# Altium schematic sheet P07 Hi3531AV100(POWER).SchDoc
size 420 x 297 mm
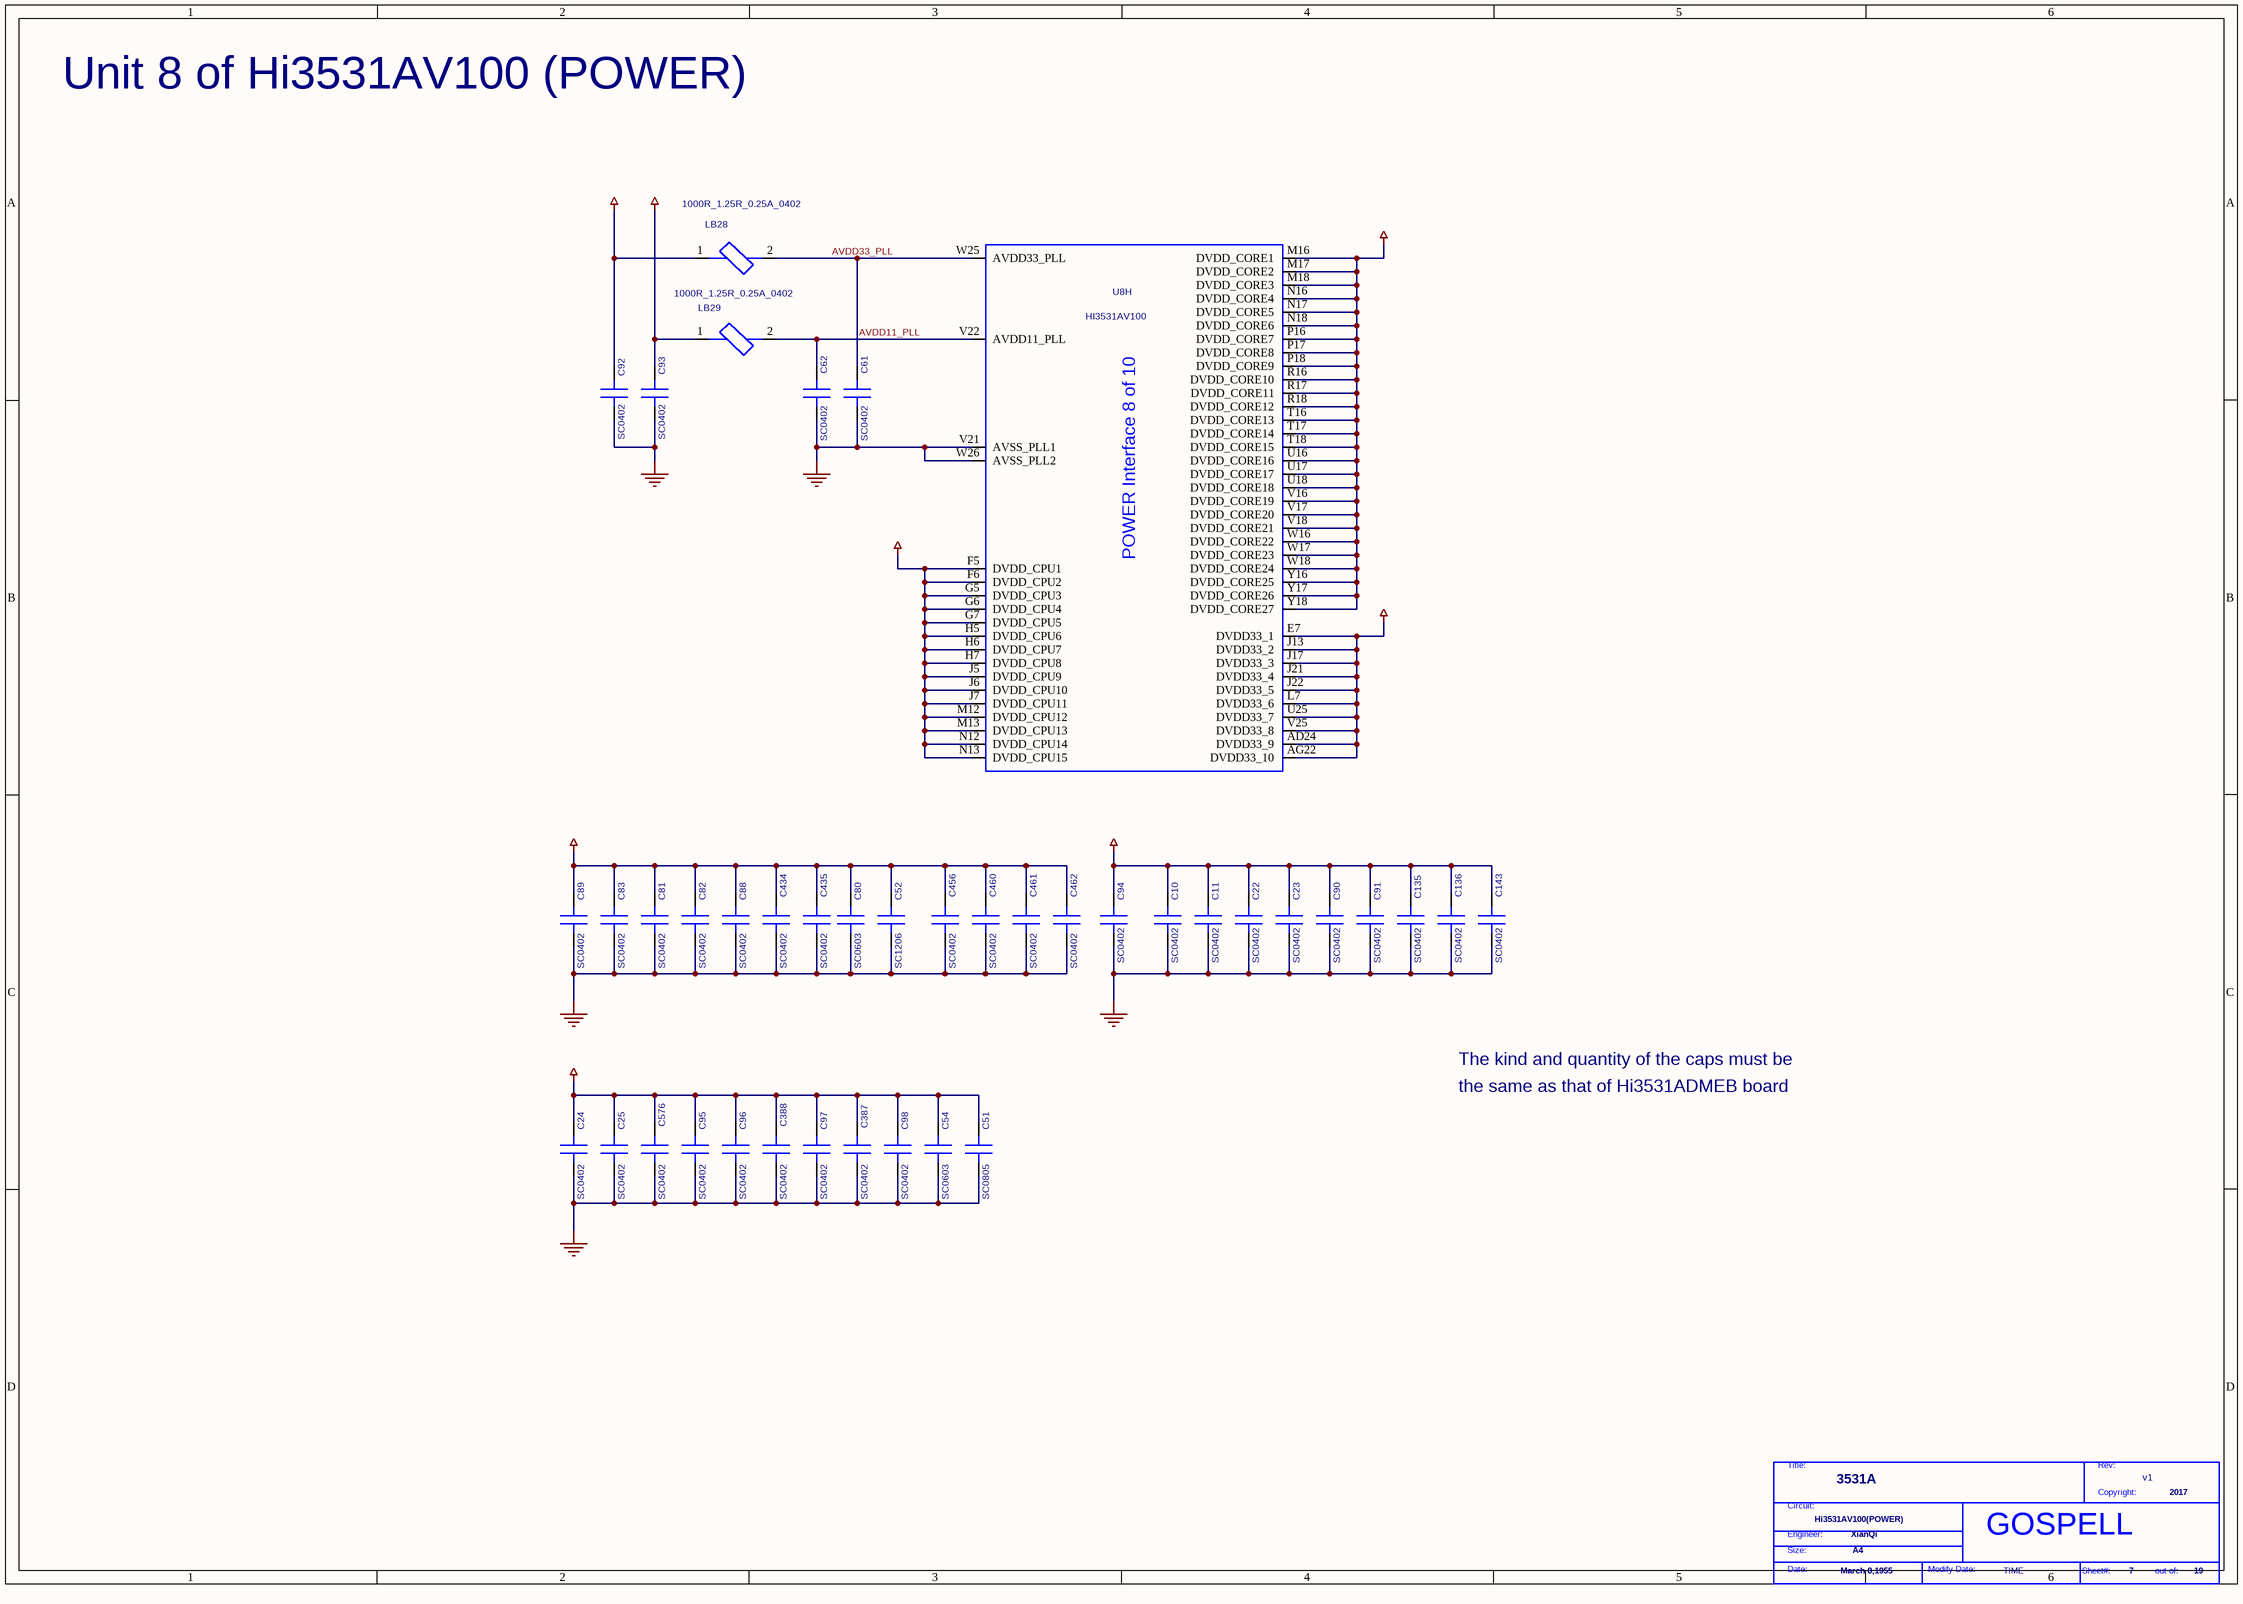
[diagram p0: P07 Hi3531AV100(POWER).SchDoc]

## Parts
*  Page Modify Date: TIME  Engineer: XianQi  Copyright: 2017  Title: 3531A  RevCode: v1  Page Size: A4  Page Create Date: March 8,1955  Page Number: 7  Page Count: 19  Doc: Hi3531AV100(POWER)  (hidden comment: GOSPELL)  (graphical)
C10  SC0402  [SC0402]
C11  SC0402  [SC0402]
C22  SC0402  [SC0402]
C23  SC0402  [SC0402]
C24  SC0402  [SC0402]
C25  SC0402  [SC0402]
C51  SC0805  [SC0805]
C52  SC1206  [SC1206]
C54  SC0603  [SC0603]
C61  SC0402  [SC0402]
C62  SC0402  [SC0402]
C80  SC0603  [SC0603]
C81  SC0402  [SC0402]
C82  SC0402  [SC0402]
C83  SC0402  [SC0402]
C88  SC0402  [SC0402]
C89  SC0402  [SC0402]
C90  SC0402  [SC0402]
C91  SC0402  [SC0402]
C92  SC0402  [SC0402]
C93  SC0402  [SC0402]
C94  SC0402  [SC0402]
C95  SC0402  [SC0402]
C96  SC0402  [SC0402]
C97  SC0402  [SC0402]
C98  SC0402  [SC0402]
C135  SC0402  [SC0402]
C136  SC0402  [SC0402]
C143  SC0402  [SC0402]
C387  SC0402  [SC0402]
C388  SC0402  [SC0402]
C434  SC0402  [SC0402]
C435  SC0402  [SC0402]
C456  SC0402  [SC0402]
C460  SC0402  [SC0402]
C461  SC0402  [SC0402]
C462  SC0402  [SC0402]
C576  SC0402  [SC0402]
LB28  SL0402  [SL0402]  (value not drawn)
LB29  SL0402  [SL0402]  (value not drawn)
U8  DEVICE: HI3531AV100  [BGA805-32-3333]  (hidden comment: BGA805-32-3333)  (part H of 10)

## Nets
3V3: C10.1(A) C11.1(A) C22.1(A) C23.1(A) C90.1(A) C91.1(A) C92.1(A) C94.1(A) C135.1(A) C136.1(A) C143.1(A) LB28.1 U8.AD24(DVDD33_9) U8.AG22(DVDD33_10) U8.E7(DVDD33_1) U8.J13(DVDD33_2) U8.J17(DVDD33_3) U8.J21(DVDD33_4) U8.J22(DVDD33_5) U8.L7(DVDD33_6) U8.U25(DVDD33_7) U8.V25(DVDD33_8)
DVDD_CORE: C24.1(A) C25.1(A) C51.1(A) C54.1(A) C93.1(A) C95.1(A) C96.1(A) C97.1(A) C98.1(A) C387.1(A) C388.1(A) C576.1(A) LB29.1 U8.M16(DVDD_CORE1) U8.M17(DVDD_CORE2) U8.M18(DVDD_CORE3) U8.N16(DVDD_CORE4) U8.N17(DVDD_CORE5) U8.N18(DVDD_CORE6) U8.P16(DVDD_CORE7) U8.P17(DVDD_CORE8) U8.P18(DVDD_CORE9) U8.R16(DVDD_CORE10) U8.R17(DVDD_CORE11) U8.R18(DVDD_CORE12) U8.T16(DVDD_CORE13) U8.T17(DVDD_CORE14) U8.T18(DVDD_CORE15) U8.U16(DVDD_CORE16) U8.U17(DVDD_CORE17) U8.U18(DVDD_CORE18) U8.V16(DVDD_CORE19) U8.V17(DVDD_CORE20) U8.V18(DVDD_CORE21) U8.W16(DVDD_CORE22) U8.W17(DVDD_CORE23) U8.W18(DVDD_CORE24) U8.Y16(DVDD_CORE25) U8.Y17(DVDD_CORE26) U8.Y18(DVDD_CORE27)
DVDD_CPU: C52.1(A) C80.1(A) C81.1(A) C82.1(A) C83.1(A) C88.1(A) C89.1(A) C434.1(A) C435.1(A) C456.1(A) C460.1(A) C461.1(A) C462.1(A) U8.F5(DVDD_CPU1) U8.F6(DVDD_CPU2) U8.G5(DVDD_CPU3) U8.G6(DVDD_CPU4) U8.G7(DVDD_CPU5) U8.H5(DVDD_CPU6) U8.H6(DVDD_CPU7) U8.H7(DVDD_CPU8) U8.J5(DVDD_CPU9) U8.J6(DVDD_CPU10) U8.J7(DVDD_CPU11) U8.M12(DVDD_CPU12) U8.M13(DVDD_CPU13) U8.N12(DVDD_CPU14) U8.N13(DVDD_CPU15)
GND: C10.2(B) C11.2(B) C22.2(B) C23.2(B) C24.2(B) C25.2(B) C51.2(B) C52.2(B) C54.2(B) C61.2(B) C62.2(B) C80.2(B) C81.2(B) C82.2(B) C83.2(B) C88.2(B) C89.2(B) C90.2(B) C91.2(B) C92.2(B) C93.2(B) C94.2(B) C95.2(B) C96.2(B) C97.2(B) C98.2(B) C135.2(B) C136.2(B) C143.2(B) C387.2(B) C388.2(B) C434.2(B) C435.2(B) C456.2(B) C460.2(B) C461.2(B) C462.2(B) C576.2(B) U8.V21(AVSS_PLL1) U8.W26(AVSS_PLL2)
AVDD11_PLL: C62.1(A) LB29.2 U8.V22(AVDD11_PLL)
AVDD33_PLL: C61.1(A) LB28.2 U8.W25(AVDD33_PLL)

## Notes on the sheet
- Unit 8 of Hi3531AV100 (POWER)
- (near LB28) 1000R_1.25R_0.25A_0402
- 1000R_1.25R_0.25A_0402
- The kind and quantity of the caps must be
- the same as that of Hi3531ADMEB board
- (in symbol GOSPELL) Title:; Rev:; Copyright:; Circuit:; Engineer:; Size:; Date:; Modify Date:; Sheet#:; out of:
- (in symbol HI3531AV100_M2_17, part H) POWER Interface 8 of 10

## Library data of the parts
C10 C23 C90 C135 C143 = C_0_Dup2: PARTS: 1; PINSWAP: (A,B); LEVEL: STD; DEVICE: RMEMK105BJ104KV_FR; OriginalSymbolOrigin: (0,30); %208%%161%%192%%224%%195%%251%%179%%198%: SMD陶瓷电容; COMPONENT_HIGH_MAX: 0.6MM; %182%%238%%182%%168%%185%%164%%215%%247%%181%%231%%209%%185%(V): 16; %195%%232%%202%%246%: SMD陶瓷电容-16V-100NF-+/-10%-X7R-0402-BT; CODE: 8070614; PKG_TYPE: SC0402
C11 C22 C91 C136 = C_0_Dup2: PARTS: 1; PINSWAP: (A,B); LEVEL: STD; DEVICE: RMEMK105BJ104KV_FR; OriginalSymbolOrigin: (0,30); CODE: 8070614; %195%%232%%202%%246%: SMD陶瓷电容-16V-100NF-+/-10%-X7R-0402-BT; %182%%238%%182%%168%%185%%164%%215%%247%%181%%231%%209%%185%(V): 16; COMPONENT_HIGH_MAX: 0.6MM; %208%%161%%192%%224%%195%%251%%179%%198%: SMD陶瓷电容; PKG_TYPE: SC0402
C24 C61 C82 C88 C92 C96 C98 C388 C434 C456 C461 C576 = C_0_Dup2: PARTS: 1; PINSWAP: (A,B); LEVEL: STD; DEVICE: CV05X5R105K10AH; OriginalSymbolOrigin: (0,30); %208%%161%%192%%224%%195%%251%%179%%198%: SMD陶瓷电容; COMPONENT_HIGH_MAX: 0.55MM; %182%%238%%182%%168%%185%%164%%215%%247%%181%%231%%209%%185%(V): 10; %195%%232%%202%%246%: SMD陶瓷电容-10V-1000NF-+/-10%-X5R-0402-BT,TS16949; CODE: 8070612; PKG_TYPE: SC0402
C25 C62 C81 C83 C89 C93 C95 C97 C387 C435 C460 C462 = C_0_Dup2: PARTS: 1; PINSWAP: (A,B); LEVEL: STD; DEVICE: CV05X5R105K10AH; OriginalSymbolOrigin: (0,30); CODE: 8070612; %195%%232%%202%%246%: SMD陶瓷电容-10V-1000NF-+/-10%-X5R-0402-BT,TS16949; %182%%238%%182%%168%%185%%164%%215%%247%%181%%231%%209%%185%(V): 10; COMPONENT_HIGH_MAX: 0.55MM; %208%%161%%192%%224%%195%%251%%179%%198%: SMD陶瓷电容; PKG_TYPE: SC0402
C51 = C_0_Dup2: PARTS: 1; PINSWAP: (A,B); LEVEL: STD; DEVICE: C2012X5R0J226MT000N; OriginalSymbolOrigin: (0,30); %208%%161%%192%%224%%195%%251%%179%%198%: SMD陶瓷电容; COMPONENT_HIGH_MAX: 1.35MM; %182%%238%%182%%168%%185%%164%%215%%247%%181%%231%%209%%185%(V): 6.3; %195%%232%%202%%246%: SMD陶瓷电容-6.3V-22000NF-+/-20%-X5R-0805-08070784编码拆分供华为技术使用; CODE: 8071114; PKG_TYPE: SC0805
C52 = C_0_Dup2: PARTS: 1; PINSWAP: (A,B); LEVEL: STD; DEVICE: GRM31CR60J226ME19L; OriginalSymbolOrigin: (0,30); %208%%161%%192%%224%%195%%251%%179%%198%: SMD陶瓷电容; COMPONENT_HIGH_MAX: 1.9MM; %182%%238%%182%%168%%185%%164%%215%%247%%181%%231%%209%%185%(V): 6.3; %195%%232%%202%%246%: SMD陶瓷电容-6.3V-22000NF-+/-20%-X5R-1206-BT,TS16949; CODE: 8070630; PKG_TYPE: SC1206
C54 C80 = C_0_Dup2: PARTS: 1; PINSWAP: (A,B); LEVEL: STD; DEVICE: C1608X5R0J106MT0A0E; OriginalSymbolOrigin: (0,30); CODE: 8070649; %195%%232%%202%%246%: SMD陶瓷电容-6.3V-10000NF-+/-20%-X5R-0603-BT,TS16949; %182%%238%%182%%168%%185%%164%%215%%247%%181%%231%%209%%185%(V): 6.3; COMPONENT_HIGH_MAX: 0.9MM; %208%%161%%192%%224%%195%%251%%179%%198%: SMD陶瓷电容; PKG_TYPE: SC0603
C94 = C_0_Dup2: PARTS: 1; PINSWAP: (A,B); LEVEL: STD; DEVICE: RMEMK105BJ104KV_FR; OriginalSymbolOrigin: (0,30); %208%%161%%192%%224%%195%%251%%179%%198%: SMD陶瓷电容; COMPONENT_HIGH_MAX: 0.6MM; %182%%238%%182%%168%%185%%164%%215%%247%%181%%231%%209%%185%(V): 16; %195%%232%%202%%246%: SMD陶瓷电容-16V-100NF-±10%-X7R-0402; CODE: 8070614; PKG_TYPE: SC0402
LB28 LB29 = LB_0: PARTS: 1; DEVICE: BLM15HG102SN1D; LEVEL: STD; OriginalSymbolOrigin: (20,50); %208%%161%%192%%224%%195%%251%%179%%198%: EMI磁珠; COMPONENT_HIGH_MAX: 0.55MM; %195%%232%%202%%246%: EMI磁珠-+/-25%-1000OHM-1.25OHM-0.25A-0402-1400OHM@1GHZ-1400OHM@1GHZ; CODE: 10070019; PKG_TYPE: SL0402
U8 = HI3531AV100_M2_17: FORWARD_PCB: 1; HETERO: (HI3531AV100_DDR1),(HI3531AV100_DDR2),(HI3531AV100_SYSTEM),(HI3531AV100_AD),(HI3531AV100_VO),(HI3531AV100_M1),(HI3531AV100_M2),(HI3531AV100_POWER),(HI3531AV100_VSS1),(HI3531AV100_VSS2); LEVEL: STD; OriginalSymbolOrigin: (30,630); CODE: 35020607; CaptureCellPackProp: HI3531AV100_M2H; PARTS: 1; PKG_TYPE: BGA805-32-3333